# Altium schematic sheet Bus_Constants.SchDoc: Bus Constants Example
size A; Organization: Altium Limited; Address1: L3, 12a Rodborough Rd; Address2: Frenchs Forest; Address3: NSW; Address4: Australia 2086; DocumentNumber: 1; SheetNumber: 1; SheetTotal: 1
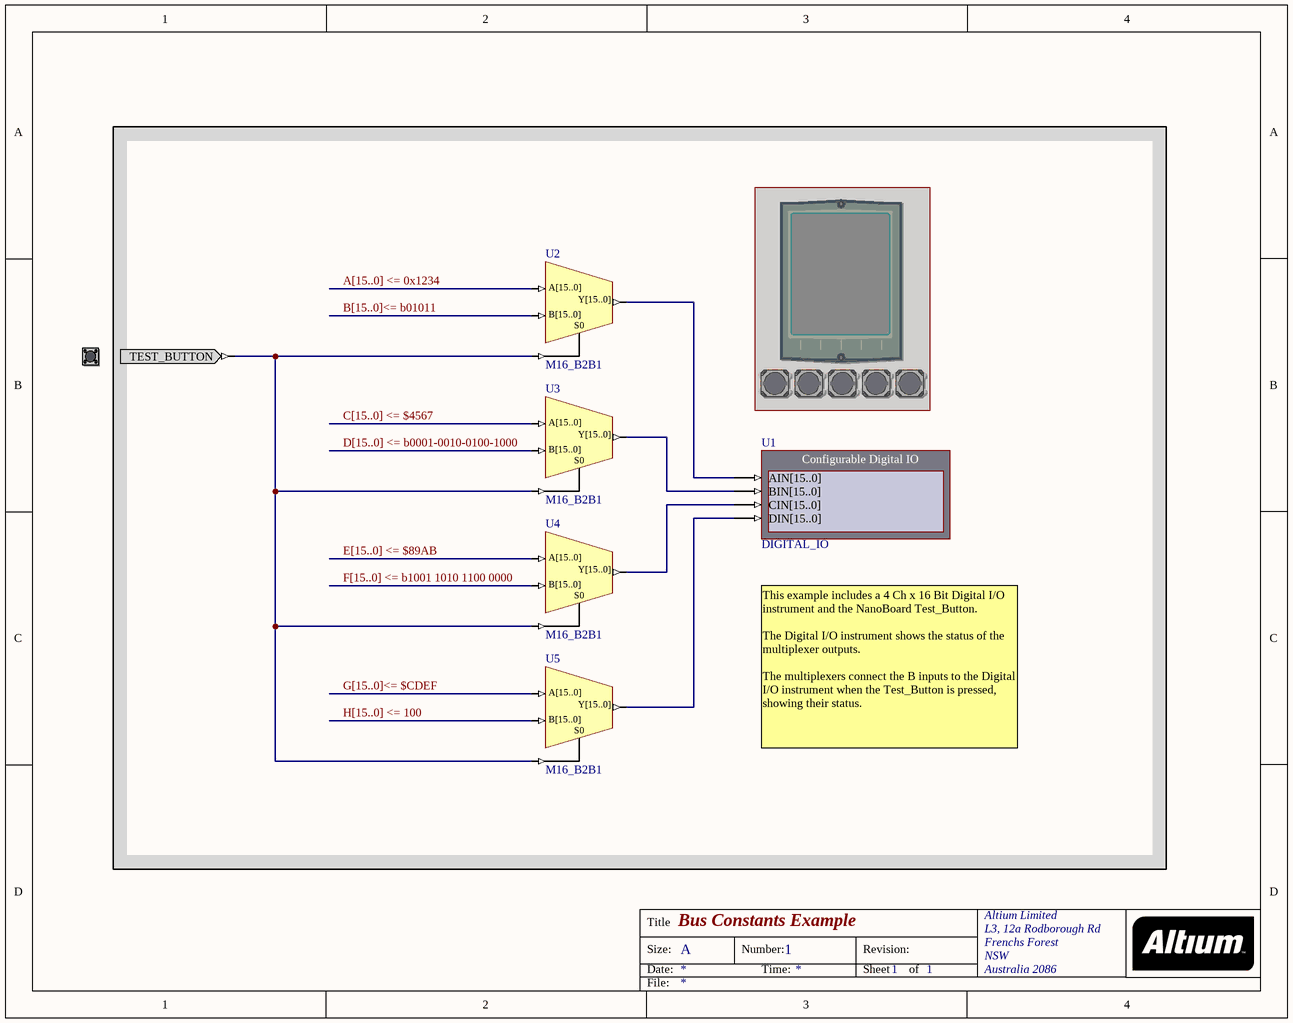
[diagram p0: Bus_Constants.SchDoc]

## Parts
(Parts that share a designator on the sheet are numbered #1, #2 ... from top to bottom, then left to right.)
?#1  FIRMWARE_TFT_ENABLE  (value not drawn)  (masked out: inside a compile mask, not in the netlist)
?#2  TEST_BUTTON  (value not drawn)
?#3  FIRMWARE_BUTTONS_ENABLE  (value not drawn)  (masked out: inside a compile mask, not in the netlist)
U1  DIGITAL_IO
U2  M16_B2B1
U3  M16_B2B1
U4  M16_B2B1
U5  M16_B2B1

## Nets
A[15..0] <= 0x1234: U2.A[15..0]
B[15..0]<= b01011: U2.B[15..0]
C[15..0] <= $4567: U3.A[15..0]
D[15..0] <= b0001-0010-0100-1000: U3.B[15..0]
E[15..0] <= $89AB: U4.A[15..0]
F[15..0] <= b1001 1010 1100 0000: U4.B[15..0]
G[15..0]<= $CDEF: U5.A[15..0]
H[15..0] <= 100: U5.B[15..0]
Net?#2_TEST_BUTTON: ?#2.TEST_BUTTON U2.S0 U3.S0 U4.S0 U5.S0
NetU1_AIN[15..0]: U1.AIN[15..0] U2.Y[15..0]
NetU1_BIN[15..0]: U1.BIN[15..0] U3.Y[15..0]
NetU1_CIN[15..0]: U1.CIN[15..0] U4.Y[15..0]
NetU1_DIN[15..0]: U1.DIN[15..0] U5.Y[15..0]

## Buses and harness runs
bus A[15..0] <= 0x1234
bus B[15..0]<= b01011
bus C[15..0] <= $4567
bus D[15..0] <= b0001-0010-0100-1000
bus E[15..0] <= $89AB
bus F[15..0] <= b1001 1010 1100 0000
bus G[15..0]<= $CDEF
bus H[15..0] <= 100

## Notes on the sheet
- This example includes a 4 Ch x 16 Bit Digital I/O instrument and the NanoBoard Test_Button.
  The Digital I/O instrument shows the status of the multiplexer outputs.
  The multiplexers connect the B inputs to the Digital I/O instrument when the Test_Button is pressed, showing their status.
- Title
- Size:
- Date:
- A
- Number:
- Time:
- Revision:
- Sheet
- of
- File:

## Library data of the parts
?#1 = FIRMWARE_TFT_ENABLE: TFT LCD Panel; PortComponent: True; Published: 22-Jan-2007; Publisher: Altium Limited; HelpURL: TR0143 Technical Reference Manual for Altium's Desktop NanoBoard NB2DSK01.pdf#page=50
?#2 = TEST_BUTTON: Test / Reset Button; PortComponent: True; Published: 19-Nov-2003; Publisher: Altium Limited; HelpURL: TR0143 Technical Reference Manual for Altium's Desktop NanoBoard NB2DSK01.pdf#page=53
?#3 = FIRMWARE_BUTTONS_ENABLE: Generic User Buttons; PortComponent: True; Published: 16-Apr-2007; Publisher: Altium Limited; HelpURL: TR0143 Technical Reference Manual for Altium's Desktop NanoBoard NB2DSK01.pdf#page=53
U1 = DIGITAL_IO: Configurable Digital IO; NEXUS_CORE: Instrument; NEXUS_JTAG_DEVICE: True; NEXUS_JTAG_ORDER: 0; ConfigurationParameters: {}Version[1.0]{}Input0Name[AIN{1}15..0{2}]{}Input0Width[16]{}Input0InitValue[0]{}Input0Kind[LEDs]{}Input0LEDStyle[Red]{}Input1Name[BIN{1}15..0{2}]{}Input1Width[16]{}Input1InitValue[0]{}Input1Kind[LEDs]{}Input1LEDStyle[Red]{}Input2Name[CIN{1}15..0{2}]{}Input2Width[16]{}Input2InitValue[0]{}Input2Kind[LEDs]{}Input2LEDStyle[Red]{}Input3Name[DIN{1}15..0{2}]{}Input3Width[16]{}Input3InitValue[0]{}Input3Kind[LEDs]{}Input3LEDStyle[Red]{}; ConfiguratorName: DIGITAL_IO; ComponentLink1Description: Core &Resource Usage; ComponentLink1URL: CR0134 FPGA Instrument Resource Usage.pdf; Core Revision: 1.00.00; HelpURL: CR0179 DIGITAL_IO Configurable Digital IO Module.pdf; LastRevisionNo: 1.00.00; Published: 28-Jun-2007; Publisher: Altium Limited; UseInDSF: True
U2-U5 = M16_B2B1: 2x16-Bit Bus to 1x16-Bit Bus Multiplexer; ArchiveName: GENERIC; Published: 18-Nov-2003; Publisher: Altium Limited; Core Revision: 1.00.00